# EAGLE design rev3 (EAGLE 9.3.0)
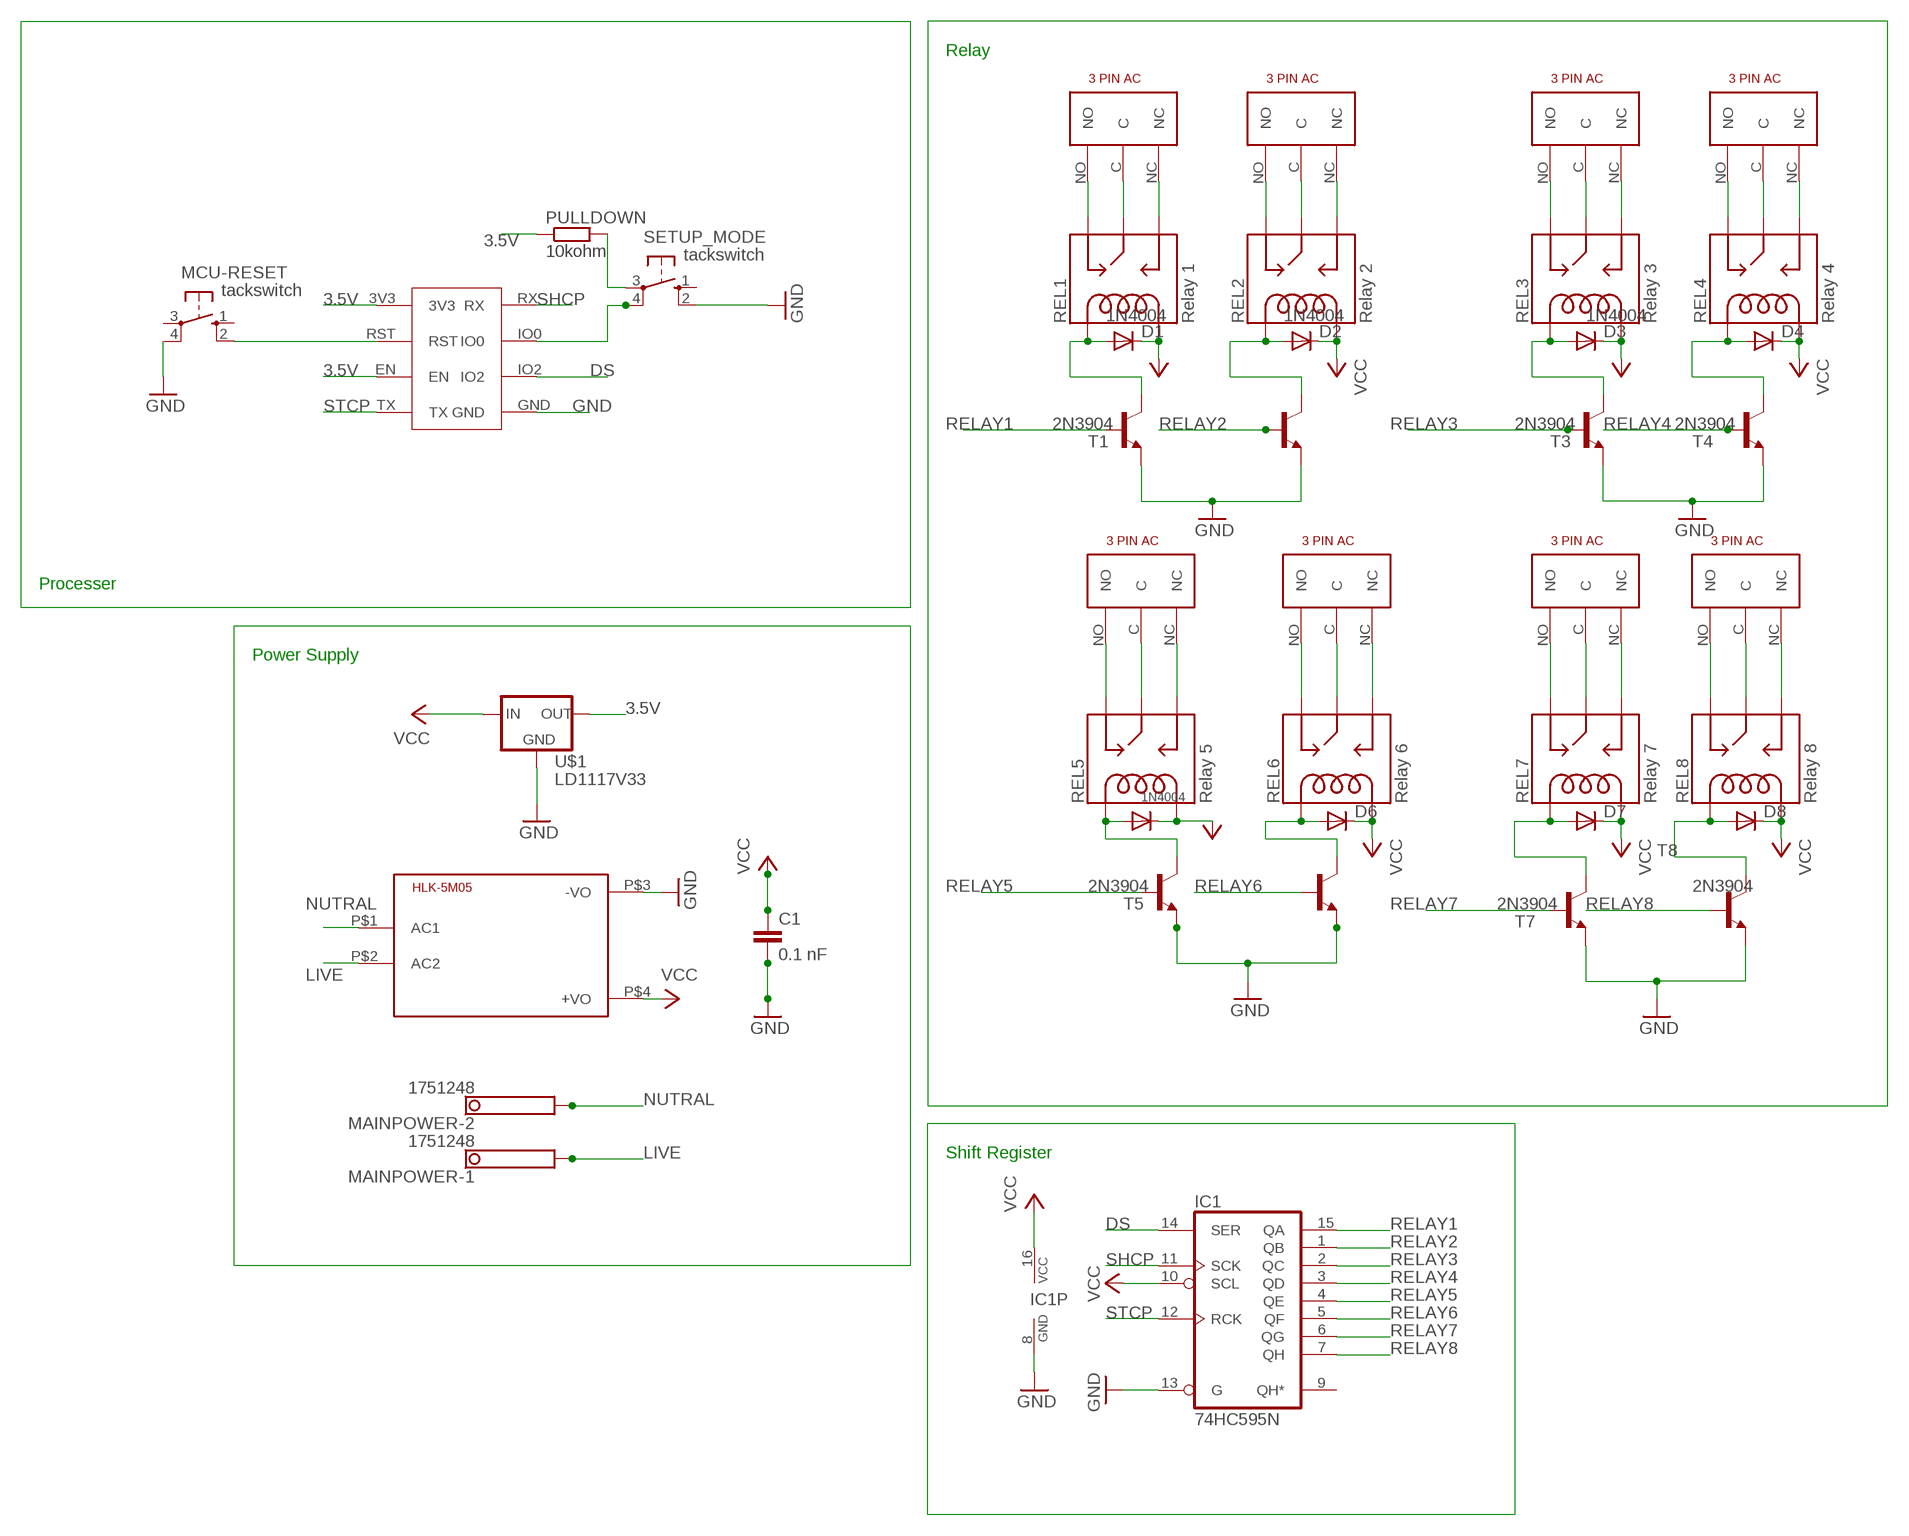
[diagram p0: schematic, sheet 1]

## Parts
C1  0.1 nF  0.1UF-KIT-EZ-50V-20%  [CAP-PTH-SMALL-KIT]
CON-REL-1  3PINAC  [LIB]
CON-REL-2  3PINAC  [LIB]
CON-REL-3  3PINAC  [LIB]
CON-REL-4  3PINAC  [LIB]
CON-REL-5  3PINAC  [LIB]
CON-REL-6  3PINAC  [LIB]
CON-REL-7  3PINAC  [LIB]
CON-REL-8  3PINAC  [LIB]
D1  1N4004  [DO41-10]
D2  1N4004  [DO41-10]
D3  1N4004  [DO41-10]
D4  1N4004  [DO41-10]
D5  1N4004  [DO41-10]
D6  1N4004  [DO41-10]
D7  1N4004  [DO41-10]
D8  1N4004  [DO41-10]
HLK-5M05  AC to DC Converter  HKLPM01  [HKLPM01]
IC1  74HC595N  [DIL16]
MAINPOWER  1751248  [1751248]
MCU-RESET  tackswitch  10-XX  [B3F-10XX]
PULLDOWN  10kohm  R-EU_0204/7  [0204/7]
REL1  Relay 1  RELAYPTH  [SRD-05VDC-SL-C]
REL2  Relay 2  RELAYPTH  [SRD-05VDC-SL-C]
REL3  Relay 3  RELAYPTH  [SRD-05VDC-SL-C]
REL4  Relay 4  RELAYPTH  [SRD-05VDC-SL-C]
REL5  Relay 5  RELAYPTH  [SRD-05VDC-SL-C]
REL6  Relay 6  RELAYPTH  [SRD-05VDC-SL-C]
REL7  Relay 7  RELAYPTH  [SRD-05VDC-SL-C]
REL8  Relay 8  RELAYPTH  [SRD-05VDC-SL-C]
SETUP_MODE  tackswitch  10-XX  [B3F-10XX]
T1  2N3904  BC618  [TO92-EBC]
T2  2N3904  BC618  [TO92-EBC]
T3  2N3904  BC618  [TO92-EBC]
T4  2N3904  BC618  [TO92-EBC]
T5  2N3904  BC618  [TO92-EBC]
T6  2N3904  BC618  [TO92-EBC]
T7  2N3904  BC618  [TO92-EBC]
T8  2N3904  BC618  [TO92-EBC]
U$1  LD1117V33  [LD1117V33]
U$2  ESP01  [ESP01]

## Nets
3.5V: PULLDOWN.1 U$1.OUT U$2.3V3 U$2.EN
DS: IC1.14(SER) U$2.IO2
GND: C1.2 HLK-5M05.P$3(-VO) IC1.8(GND) IC1.13(G) MCU-RESET.4(P1) SETUP_MODE.2(S1) T1.E T2.E T3.E T4.E T5.E T6.E T7.E T8.E U$1.GND U$2.GND
LIVE: HLK-5M05.P$2(AC2) MAINPOWER.1
N$1: D5.A REL5.COIL1 T5.C
N$2: D6.A REL6.COIL1 T6.C
N$3: D7.A REL7.COIL1 T7.C
N$4: D8.A REL8.COIL1 T8.C
N$5: D4.A REL4.COIL1 T4.C
N$6: D3.A REL3.COIL1 T3.C
N$7: SETUP_MODE.4(P1) U$2.IO0
N$8: D2.A REL2.COIL1 T2.C
N$9: D1.A REL1.COIL1 T1.C
N$10: CON-REL-5.NC REL5.SWOPEN
N$11: CON-REL-5.C REL5.SWCOMMON
N$12: CON-REL-5.NO REL5.SWCLOSED(SWCLOSE)
N$13: CON-REL-6.NC REL6.SWOPEN
N$14: CON-REL-6.C REL6.SWCOMMON
N$15: CON-REL-6.NO REL6.SWCLOSED(SWCLOSE)
N$16: CON-REL-7.NC REL7.SWOPEN
N$17: CON-REL-7.C REL7.SWCOMMON
N$18: CON-REL-7.NO REL7.SWCLOSED(SWCLOSE)
N$19: CON-REL-8.NC REL8.SWOPEN
N$20: CON-REL-8.C REL8.SWCOMMON
N$21: CON-REL-8.NO REL8.SWCLOSED(SWCLOSE)
N$22: CON-REL-4.NC REL4.SWOPEN
N$23: CON-REL-4.C REL4.SWCOMMON
N$24: CON-REL-4.NO REL4.SWCLOSED(SWCLOSE)
N$25: CON-REL-3.NC REL3.SWOPEN
N$26: PULLDOWN.2 SETUP_MODE.3(P)
N$31: MCU-RESET.2(S1) U$2.RST
N$39: CON-REL-3.C REL3.SWCOMMON
N$40: CON-REL-3.NO REL3.SWCLOSED(SWCLOSE)
N$41: CON-REL-2.NC REL2.SWOPEN
N$42: CON-REL-2.C REL2.SWCOMMON
N$43: CON-REL-2.NO REL2.SWCLOSED(SWCLOSE)
N$44: CON-REL-1.NC REL1.SWOPEN
N$45: CON-REL-1.C REL1.SWCOMMON
N$46: CON-REL-1.NO REL1.SWCLOSED(SWCLOSE)
NUTRAL: HLK-5M05.P$1(AC1) MAINPOWER.2
RELAY1: IC1.15(QA) T1.B
RELAY2: IC1.1(QB) T2.B
RELAY3: IC1.2(QC) T3.B
RELAY4: IC1.3(QD) T4.B
RELAY5: IC1.4(QE) T5.B
RELAY6: IC1.5(QF) T6.B
RELAY7: IC1.6(QG) T7.B
RELAY8: IC1.7(QH) T8.B
SHCP: IC1.11(SCK) U$2.RX
STCP: IC1.12(RCK) U$2.TX
VCC: C1.1 D1.C D2.C D3.C D4.C D5.C D6.C D7.C D8.C HLK-5M05.P$4(+VO) IC1.10(SCL) IC1.16(VCC) REL1.COIL0 REL2.COIL0 REL3.COIL0 REL4.COIL0 REL5.COIL0 REL6.COIL0 REL7.COIL0 REL8.COIL0 U$1.IN
Unconnected: IC1.9(QH*) MCU-RESET.1(S) MCU-RESET.3(P) SETUP_MODE.1(S)

## Notes on the sheet
- Relay
- Processer
- Power Supply
- Shift Register

## Library data of the parts
C1 = SparkFun-Capacitors:0.1UF: 0.1µF ceramic capacitors A capacitor is a passive two-terminal electrical component used to store electrical energy temporarily in an electric field.; PROD_ID: CAP-08370; VALUE: 0.1uF
CON-REL-1-CON-REL-8 = 3 PIN AC Connector:3PINAC
D1-D8 = adafruit:1N4004: DIODE General purpose 1N400x type rectifier (With bigger pads) http://www.ladyada.net/library/pcb/eaglelibrary.html
HLK-5M05 = HLKPM01EaglesLib:HKLPM01
IC1 = 74xx:74*595: 8-bit SHIFT REGISTER, output latch
MAINPOWER = con-phoenix-350:1751248: MKDS 1/ 2-3,5 Printklemme Nennstrom: 10 A Bemessungsspannung: 160 V Raster: 3,5 mm Polzahl: 2 Montageart: Löten Anschlussart: Schraubanschluss Anschlussrichtung vom Leiter zur Platine: 0° Source: http://eshop.phoenixcontact.com .. 1751248.pdf; OC_FARNELL: unknown; OC_NEWARK: unknown
MCU-RESET SETUP_MODE = buttons:10-XX: OMRON SWITCH
PULLDOWN = resistor:R-EU_: RESISTOR, European symbol
REL1-REL8 = SRD-05VDC-SL-C:RELAY: SPDT relay (COM-00101)
T1-T8 = transistor-npn:BC618*: NPN Transistor
U$1 = LD1117V33:LD1117V33
U$2 = Esp01:ESP01

## Net classes
0 default: width 0.5 mm, clearance 0.205 mm

## Board
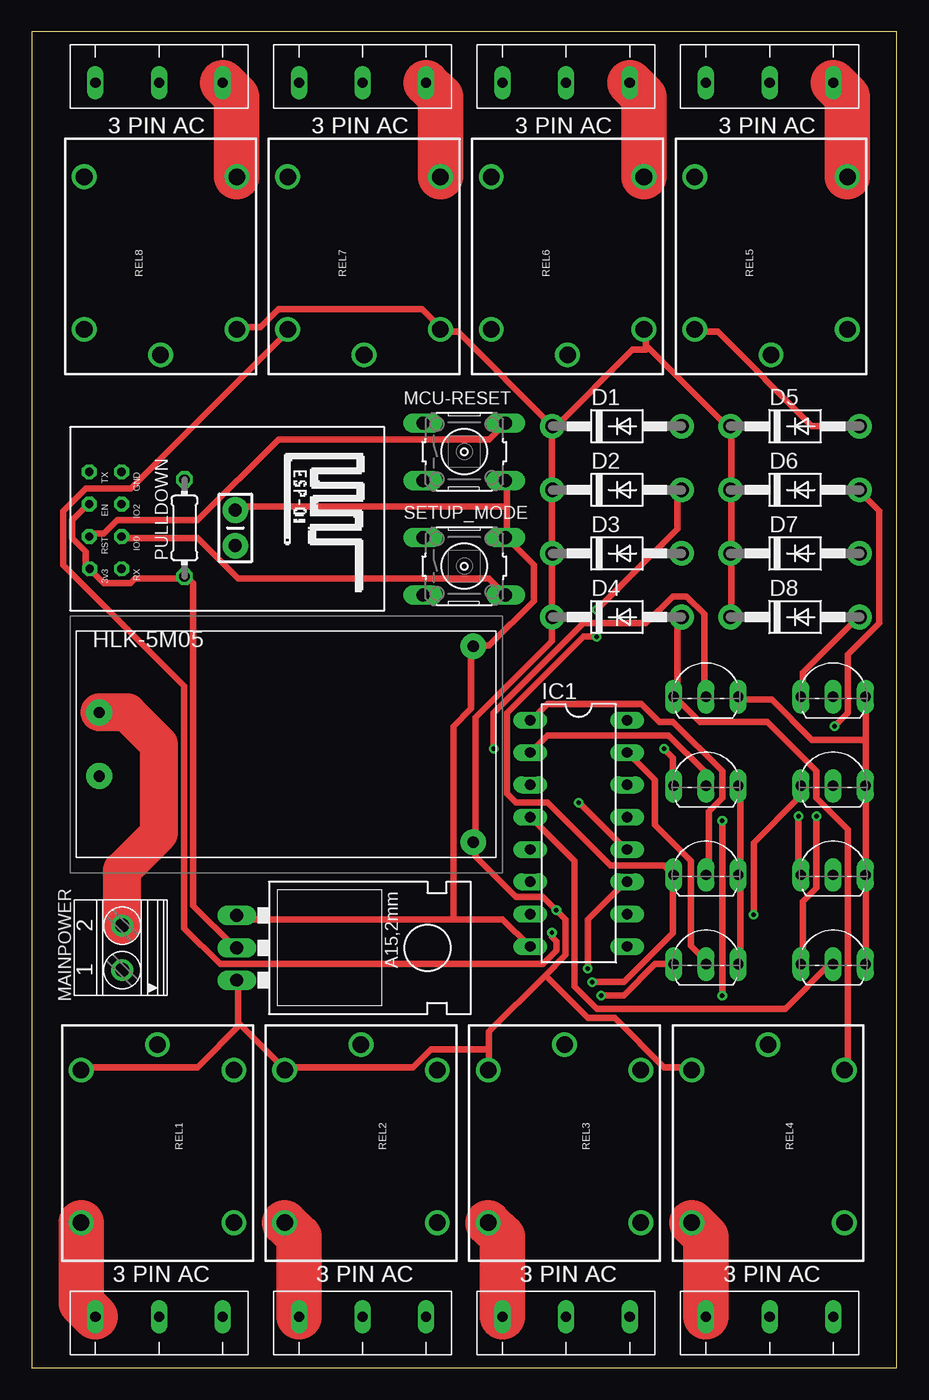
[diagram p1: board, top side]
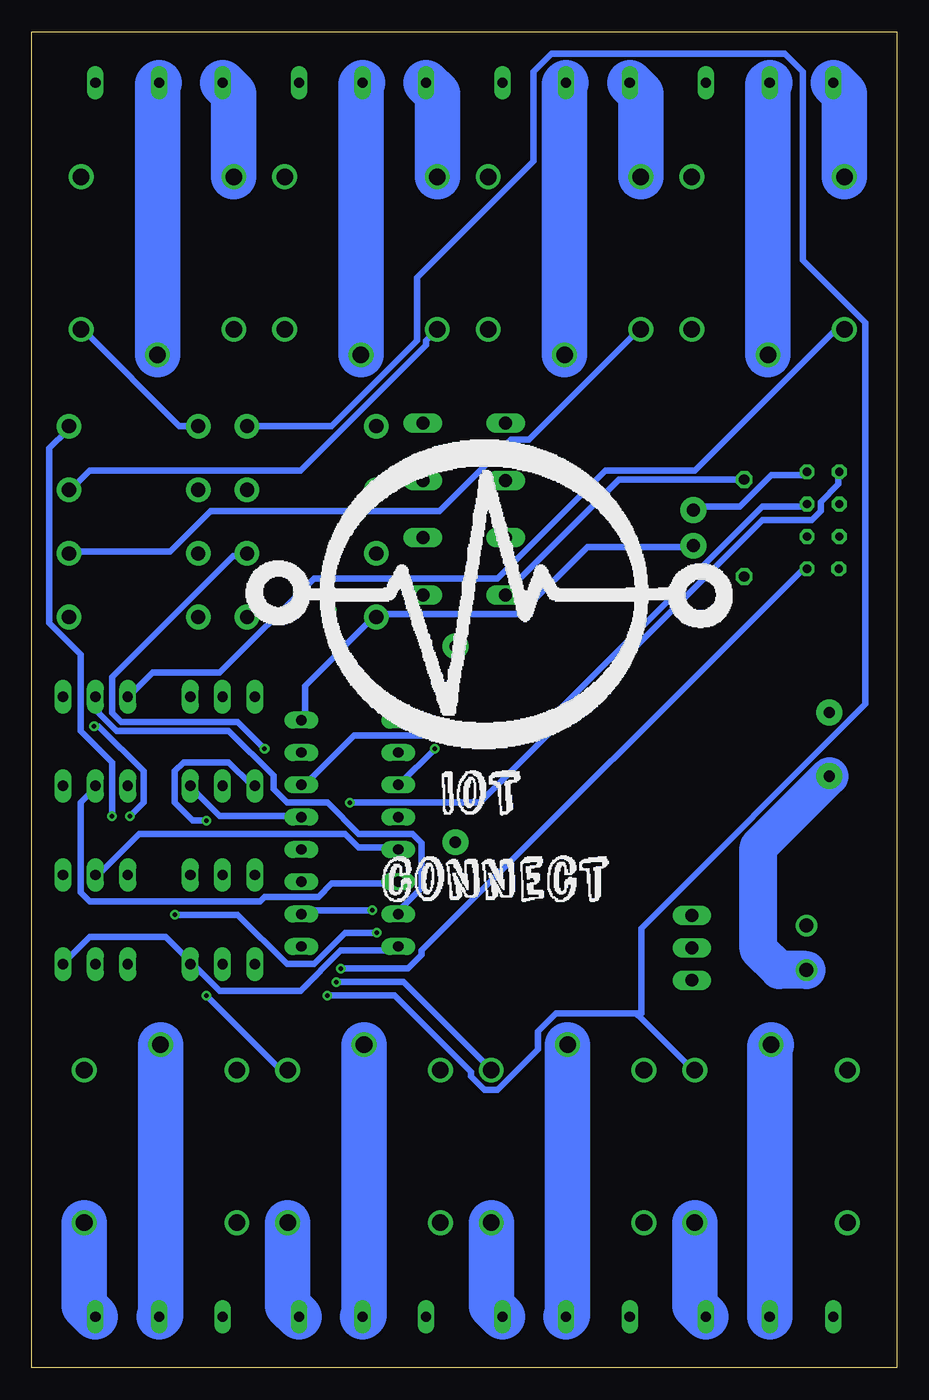
[diagram p2: board, bottom side, seen from below]

Size 68 x 105 mm. Coordinates in mm from the lower left corner, seen from the top.
Outline: 0,0 68,0 68,105 0,105 0,0
Copper layers (1*16): Top 0.035mm / dielectric 1.5mm / Bottom 0.035mm
Design rules "default *": minimum track width 6mil, minimum drill 0.35mm, track to track 6mil, track to pad 6mil, pad to pad 6mil, via to via 12mil, smd to smd 6mil, copper to edge 40mil, drill to drill 6mil, minimum pad ring 10mil, minimum via ring 8mil, stop-mask expansion 4mil, vias tented up to drill 0mil, thermal gap 10mil

### Footprints (pad centres in the part's own frame; a part is rotated, then mirrored left to right if it is on the bottom)
CAP-PTH-SMALL-KIT = drill 1.016 pad 2.032: 1 -1.397,0; 2 1.397,0
LIB = drill 0.8 long: C 5,0; NC 0,0; NO 10,0
DO41-10 = drill 1.118 pad 1.93: A 5.08,0; C -5.08,0
HKLPM01 = drill 0.889 pad 2.032: P$1 -14.7,2.5; P$2 -14.7,-2.5; P$3 14.7,7.7; P$4 14.7,-7.7
DIL16 = drill 0.813 long: 1 -8.89,-3.81; 2 -6.35,-3.81; 3 -3.81,-3.81; 4 -1.27,-3.81; 5 1.27,-3.81; 6 3.81,-3.81; 7 6.35,-3.81; 8 8.89,-3.81; 9 8.89,3.81; 10 6.35,3.81; 11 3.81,3.81; 12 1.27,3.81; 13 -1.27,3.81; 14 -3.81,3.81; 15 -6.35,3.81; 16 -8.89,3.81
1751248 = drill 1.1 pad 1.7: 1 -1.75,-0.1; 2 1.75,-0.1
B3F-10XX = drill 1.016 long: 1 -3.251,2.261; 2 3.251,2.261; 3 -3.251,-2.261; 4 3.251,-2.261
0204/7 = drill 0.813 octagon: 1 -3.81,0; 2 3.81,0
SRD-05VDC-SL-C = drill 1.3: COIL0 -5.39,-6.12; COIL1 -5.39,5.88; SWCLOSED 6.61,-6.12; SWCOMMON -7.39,-0.12; SWOPEN 6.61,5.88
TO92-EBC = drill 0.813 long: B 0,-1.27; C -2.54,-1.27; E 2.54,-1.27
LD1117V33 = drill 1.016 long: GND -2.54,-8.89; IN 2.54,-8.89; OUT 0,-8.89
ESP01 = drill 0.65 octagon: 3V3 4.205,-9.443; EN -0.875,-9.483; GND -3.415,-6.943; IO0 1.665,-6.943; IO2 -0.875,-6.943; RST 1.665,-9.483; RX 4.205,-6.943; TX -3.415,-9.483

### Placement (x,y rotation side)
C1  16,66 90 top
CON-REL-1  15,4 180 top
CON-REL-2  31,4 180 top
CON-REL-3  47,4 180 top
CON-REL-4  63,4 180 top
CON-REL-5  53,101 0 top
CON-REL-6  37,101 0 top
CON-REL-7  21,101 0 top
CON-REL-8  5,101 0 top
D1  46,74 0 top
D2  46,69 0 top
D3  46,64 0 top
D4  46,59 0 top
D5  60,74 0 top
D6  60,69 0 top
D7  60,64 0 top
D8  60,59 0 top
HLK-5M05  20,49 0 top
IC1  43,42 270 top
MAINPOWER  7,33 90 top
MCU-RESET  34,72 0 top
PULLDOWN  12,66 90 top
REL1  10,18 270 top
REL2  26,18 270 top
REL3  42,18 270 top
REL4  58,18 270 top
REL5  58,87 90 top
REL6  42,87 90 top
REL7  26,87 90 top
REL8  10,87 90 top
SETUP_MODE  34,63 0 top
T1  53,33 0 top
T2  53,40 0 top
T3  53,47 0 top
T4  53,54 0 top
T5  63,33 0 top
T6  63,40 0 top
T7  63,47 0 top
T8  63,54 0 top
U$1  25,33 270 top
U$2  14,67 270 top

### Tracks (layer width: path | path; a pad name or v marks a point on that pad's centre or on a via)
3.5V
  Top 0.5: U$2.EN 4.23,67.68 3.17,66.62 3.17,65.21 4.23,64.16 4.23,63.1 U$2.3V3 4.58,62.74 5.64,61.69 7.75,61.69 8.11,62.04 11.98,62.04 PULLDOWN.1 12.34,62.04 12.69,61.69 12.69,36.31 15.86,33.13 U$1.OUT
DS
  Bottom 0.5: U$2.IO2 7.4,67.68 10.57,67.68 28.55,49.7 42.65,49.7 46.53,45.83 IC1.14
GND
  Top 0.5: 37.37,67.68 37.37,69.44 MCU-RESET.4 | 37.37,67.68 37.37,65.56 SETUP_MODE.2 37.37,65.21 39.48,63.1 39.48,60.28 35.95,56.75 34.9,56.75 HLK-5M05.P$3 34.55,56.4 34.55,51.82 33.13,50.41 33.13,35.25 | 37.37,67.68 16.21,67.68 C1.2 | T5.E 65.56,32.08 65.56,38.42 T6.E 65.56,38.77 65.56,45.47 T7.E 65.56,45.83 65.56,49.35 | 65.56,49.35 65.56,52.52 T8.E | 65.56,49.35 61.34,49.35 58.16,52.52 55.7,52.52 T4.E | T1.E 55.7,32.08 55.7,38.42 T2.E 55.7,38.77 55.7,45.47 T3.E | 33.13,35.25 37.01,35.25 39.13,33.13 IC1.8 | 33.13,35.25 16.21,35.25 U$1.GND
  Bottom 0.5: U$2.GND 7.4,70.15 9.87,70.15 12.34,67.68 15.86,67.68 C1.2 | IC1.13 46.88,43.36 53.23,43.36 55.34,45.47 T3.E | IC1.8 39.48,32.78 43.71,32.78 46.88,29.61 53.23,29.61 55.34,31.73 T1.E 55.7,32.08 57.46,33.84 63.45,33.84 65.21,32.08 T5.E
LIVE
  Bottom 3: MAINPOWER.1 9.25,31.25 10.88,32.88 10.88,40.92 HLK-5M05.P$2
N$1  (via drill 0.35)
  Top 0.5: v61.69,43.36 61.69,37.72 60.63,36.66 60.63,32.08 T5.C | REL5.COIL1 52.17,81.43 53.93,81.43 61.34,74.03 64.86,74.03 D5.A
  Bottom 0.5: v61.69,43.36 61.69,47.59 64.16,50.05 64.16,56.05 66.62,58.52 66.62,72.26 65.21,73.67 D5.A
N$2  (via drill 0.35)
  Top 0.5: v60.28,43.36 60.28,38.77 T6.C | v63.1,50.41 64.16,51.47 64.16,56.05 66.62,58.52 66.62,67.33 65.21,68.74 D6.A
  Bottom 0.5: v60.28,43.36 59.22,44.41 59.22,46.88 62.74,50.41 v63.1,50.41 | REL6.COIL1 36.31,81.43 37.01,80.72 37.01,80.37 46.88,70.5 63.45,70.5 64.86,69.09 D6.A
N$3  (via drill 0.35)
  Top 0.5: v56.75,35.6 56.75,41.24 60.28,44.77 60.28,45.47 T7.C | v40.89,34.19 40.89,33.84 41.24,33.49 41.24,32.78 40.19,31.73 14.8,31.73 11.98,34.55 11.98,53.58 2.47,63.1 2.47,67.33 4.23,69.09 7.75,69.09 20.09,81.43 REL7.COIL1
  Bottom 0.5: v56.75,35.6 51.82,35.6 47.94,31.73 45.83,31.73 43.36,34.19 v40.89,34.19 | D7.A 64.86,64.16 57.1,64.16 53.93,67.33 35.95,67.33 30.32,72.97 28.91,72.97 20.45,81.43 REL7.COIL1
N$4
  Top 0.5: T8.C 60.63,52.88 60.63,54.64 64.86,58.87 D8.A
  Bottom 0.5: REL8.COIL1 4.23,81.43 4.93,81.43 15.86,70.5 22.91,70.5 31.37,62.04 45.83,62.04 53.23,54.64 58.52,54.64 60.28,52.88 T8.C
N$5
  Top 0.5: D4.A 50.76,58.87 50.76,52.88 T4.C 50.76,52.52 52.52,50.76 57.81,50.76 61.69,46.88 61.69,44.77 64.16,42.3 64.16,23.62 REL4.COIL1
N$6  (via drill 0.35)
  Top 0.5: v49.7,48.65 50.41,47.94 50.41,45.83 T3.C | v54.28,43.01 v54.28,29.26
  Bottom 0.5: v49.7,48.65 51.82,50.76 60.98,50.76 61.69,51.47 61.69,54.28 52.17,63.8 51.11,63.8 D3.A | v54.28,29.26 48.65,23.62 47.94,23.62 REL3.COIL1 | v54.28,43.01 55.34,43.01 56.75,44.41 56.75,46.88 56.05,47.59 52.52,47.59 50.76,45.83 T3.C
N$7
  Top 0.5: U$2.IO0 7.4,65.21 13.04,65.21 16.21,62.04 35.95,62.04 37.01,60.98 SETUP_MODE.4
N$8  (via drill 0.35)
  Top 0.5: v44.06,30.32 46.53,30.32 50.41,34.19 50.41,38.42 T2.C 50.41,38.77 49.7,39.48 45.47,39.48 40.54,44.41 38.07,44.41 37.37,45.12 37.37,51.47 43.36,57.46 v44.41,57.46 | v44.41,59.57 50.76,65.92 50.76,68.74 D2.A
  Bottom 0.5: v44.06,30.32 38.77,30.32 32.08,23.62 REL2.COIL1 | v44.41,57.46 v44.41,59.57
N$9  (via drill 0.35)
  Top 0.5: v44.77,29.26 46.53,29.26 49,31.73 50.41,31.73 T1.C
  Bottom 0.5: v44.77,29.26 39.48,29.26 33.49,23.27 33.49,22.91 32.43,21.86 31.37,21.86 28.2,25.03 28.2,26.44 26.79,27.85 20.45,27.85 20.27,27.67 | 20.27,27.67 16.21,23.62 REL1.COIL1 | D1.A 50.76,74.03 44.41,74.03 37.72,80.72 37.72,85.66 28.55,94.82 28.55,101.87 27.14,103.28 8.81,103.28 7.4,101.87 7.4,87.07 2.47,82.13 2.47,52.17 20.09,34.55 20.09,27.85 20.27,27.67
N$10
  Bottom 3.56: REL5.SWOPEN 52.12,100.12 CON-REL-5.NC
N$11
  Bottom 3.56: REL5.SWCOMMON 58.12,100.88 CON-REL-5.C
N$12
  Top 3.56: REL5.SWCLOSED 64.12,99.88 CON-REL-5.NO
N$13
  Bottom 3.56: REL6.SWOPEN 36.12,100.12 CON-REL-6.NC
N$14
  Bottom 3.56: REL6.SWCOMMON 42.12,100.88 CON-REL-6.C
N$15
  Top 3.56: REL6.SWCLOSED 48.12,99.88 CON-REL-6.NO
N$16
  Bottom 3.56: REL7.SWOPEN 20.12,100.12 CON-REL-7.NC
N$17
  Bottom 3.56: REL7.SWCOMMON 26.12,100.88 CON-REL-7.C
N$18
  Top 3.56: REL7.SWCLOSED 32.12,99.88 CON-REL-7.NO
N$19
  Bottom 3.56: REL8.SWOPEN 4.12,100.12 CON-REL-8.NC
N$20
  Bottom 3.56: REL8.SWCOMMON 10.12,100.88 CON-REL-8.C
N$21
  Top 3.56: REL8.SWCLOSED 16.12,99.88 CON-REL-8.NO
N$22
  Bottom 3.56: REL4.SWOPEN 63.88,4.88 CON-REL-4.NC
N$23
  Bottom 3.56: REL4.SWCOMMON 57.88,4.12 CON-REL-4.C
N$24
  Top 3.56: REL4.SWCLOSED 53,10.27 CON-REL-4.NO
N$25
  Bottom 3.56: REL3.SWOPEN 47.88,4.88 CON-REL-3.NC
N$26
  Bottom 0.5: PULLDOWN.2 12.34,69.8 21.86,69.8 30.67,60.98 SETUP_MODE.3
N$31
  Top 0.5: U$2.RST 4.58,65.56 5.64,65.56 6.7,66.62 13.04,66.62 19.39,72.97 35.95,72.97 37.01,74.03 MCU-RESET.2
N$39
  Bottom 3.56: REL3.SWCOMMON 41.88,4.12 CON-REL-3.C
N$40
  Top 3.56: REL3.SWCLOSED 37,10.27 CON-REL-3.NO
N$41
  Bottom 3.56: REL2.SWOPEN 31.88,4.88 CON-REL-2.NC
N$42
  Bottom 3.56: REL2.SWCOMMON 25.88,4.12 CON-REL-2.C
N$43
  Top 3.56: REL2.SWCLOSED 21,10.27 CON-REL-2.NO
N$44
  Bottom 3.56: REL1.SWOPEN 15.88,4.88 CON-REL-1.NC
N$45
  Bottom 3.56: REL1.SWCOMMON 10,25.27 CON-REL-1.C
N$46
  Top 3.56: REL1.SWCLOSED 3.88,5.12 CON-REL-1.NO
NUTRAL
  Top 3: MAINPOWER.2 7.1,39.1 10,42 10,49 7.5,51.5 HLK-5M05.P$1
RELAY1
  Top 0.5: IC1.15 46.88,48.29 49,46.18 49,42.65 51.82,39.83 51.82,33.13 52.88,32.08 T1.B
RELAY2
  Top 0.5: T2.B 53.23,38.77 53.23,43.71 54.28,44.77 54.28,46.88 50.41,50.76 49.35,50.76 47.94,52.17 40.54,52.17 39.48,51.11 IC1.1
RELAY3
  Top 0.5: T3.B 52.88,45.83 52.88,46.88 50.05,49.7 40.54,49.7 39.48,48.65 IC1.2
RELAY4  (via drill 0.35)
  Top 0.5: v36.31,48.65 36.31,51.47 43.36,58.52 48.29,58.52 50.41,60.63 51.47,60.63 52.88,59.22 52.88,52.88 T4.B
  Bottom 0.5: v36.31,48.65 39.13,45.83 IC1.3
RELAY5
  Top 0.5: T5.B 62.74,31.73 59.22,28.2 44.41,28.2 42.65,29.96 42.65,39.83 39.48,43.01 IC1.4
RELAY6
  Bottom 0.5: T6.B 62.74,38.77 59.57,41.95 43.36,41.95 42.3,40.89 39.48,40.89 IC1.5
RELAY7
  Bottom 0.5: IC1.6 39.48,38.07 44.41,38.07 45.47,37.01 49.7,37.01 50.05,36.66 63.45,36.66 64.16,37.37 64.16,44.41 63.1,45.47 T7.B
RELAY8
  Bottom 0.5: IC1.7 39.13,35.95 37.37,37.72 37.37,41.24 38.07,41.95 42.3,41.95 44.77,44.41 47.94,44.41 49,45.47 49,46.53 52.52,50.05 61.34,50.05 62.74,51.47 62.74,52.52 T8.B
SHCP  (via drill 0.35)
  Top 0.5: v43.71,31.37 43.71,35.25 46.53,38.07 IC1.11
  Bottom 0.5: v43.71,31.37 38.42,31.37 37.37,32.43 37.37,32.78 7.4,62.74 U$2.RX
STCP  (via drill 0.35)
  Top 0.5: v43.01,44.41 46.53,40.89 IC1.12
  Bottom 0.5: v43.01,44.41 32.78,44.41 10.57,66.62 6.7,66.62 5.99,67.33 5.99,68.03 4.58,69.44 4.58,70.15 U$2.TX
VCC  (via drill 0.35)
  Top 0.5: 16.39,26.97 19.74,23.62 REL2.COIL0 20.09,23.62 29.96,23.62 31.37,25.03 35.95,25.03 | 16.39,26.97 16.21,27.14 16.21,30.32 U$1.IN | 16.39,26.97 13.04,23.62 4.23,23.62 REL1.COIL0 | 35.95,25.03 35.95,26.44 40.36,30.84 | 35.95,25.03 35.95,23.62 REL3.COIL0 | 40.36,30.84 41.95,32.43 41.95,35.25 v41.24,35.95 40.19,37.01 38.07,37.01 34.9,40.19 34.9,41.24 HLK-5M05.P$4 34.9,41.59 34.9,51.11 40.89,57.1 40.89,58.87 D4.C 40.89,59.22 40.89,63.8 D3.C 40.89,64.16 40.89,68.74 D2.C 40.89,69.09 40.89,73.67 D1.C | 40.36,30.84 43.71,27.5 45.83,27.5 49.7,23.62 51.82,23.62 REL4.COIL0 | D8.C 54.99,59.22 54.99,63.8 D7.C 54.99,64.16 54.99,68.74 D6.C 54.99,69.09 54.99,73.67 D5.C 54.64,74.03 48.47,80.19 | 48.47,80.19 48.29,80.37 48.29,81.43 REL6.COIL0 | REL8.COIL0 16.21,81.78 17.98,81.78 19.39,83.19 30.67,83.19 32.08,81.78 REL7.COIL0 32.43,81.43 33.49,81.43 40.89,74.03 D1.C | 48.47,80.19 48.29,80.02 47.23,80.02 41.24,74.03 D1.C
  Bottom 0.5: v41.24,35.95 46.53,35.95 IC1.10 | REL5.COIL0 63.8,81.43 56.4,74.03 54.99,74.03 D5.C | IC1.16 46.53,51.11 46.53,53.58 41.24,58.87 D4.C 40.89,59.22 29.61,59.22 24.32,64.51 16.21,64.51 C1.1